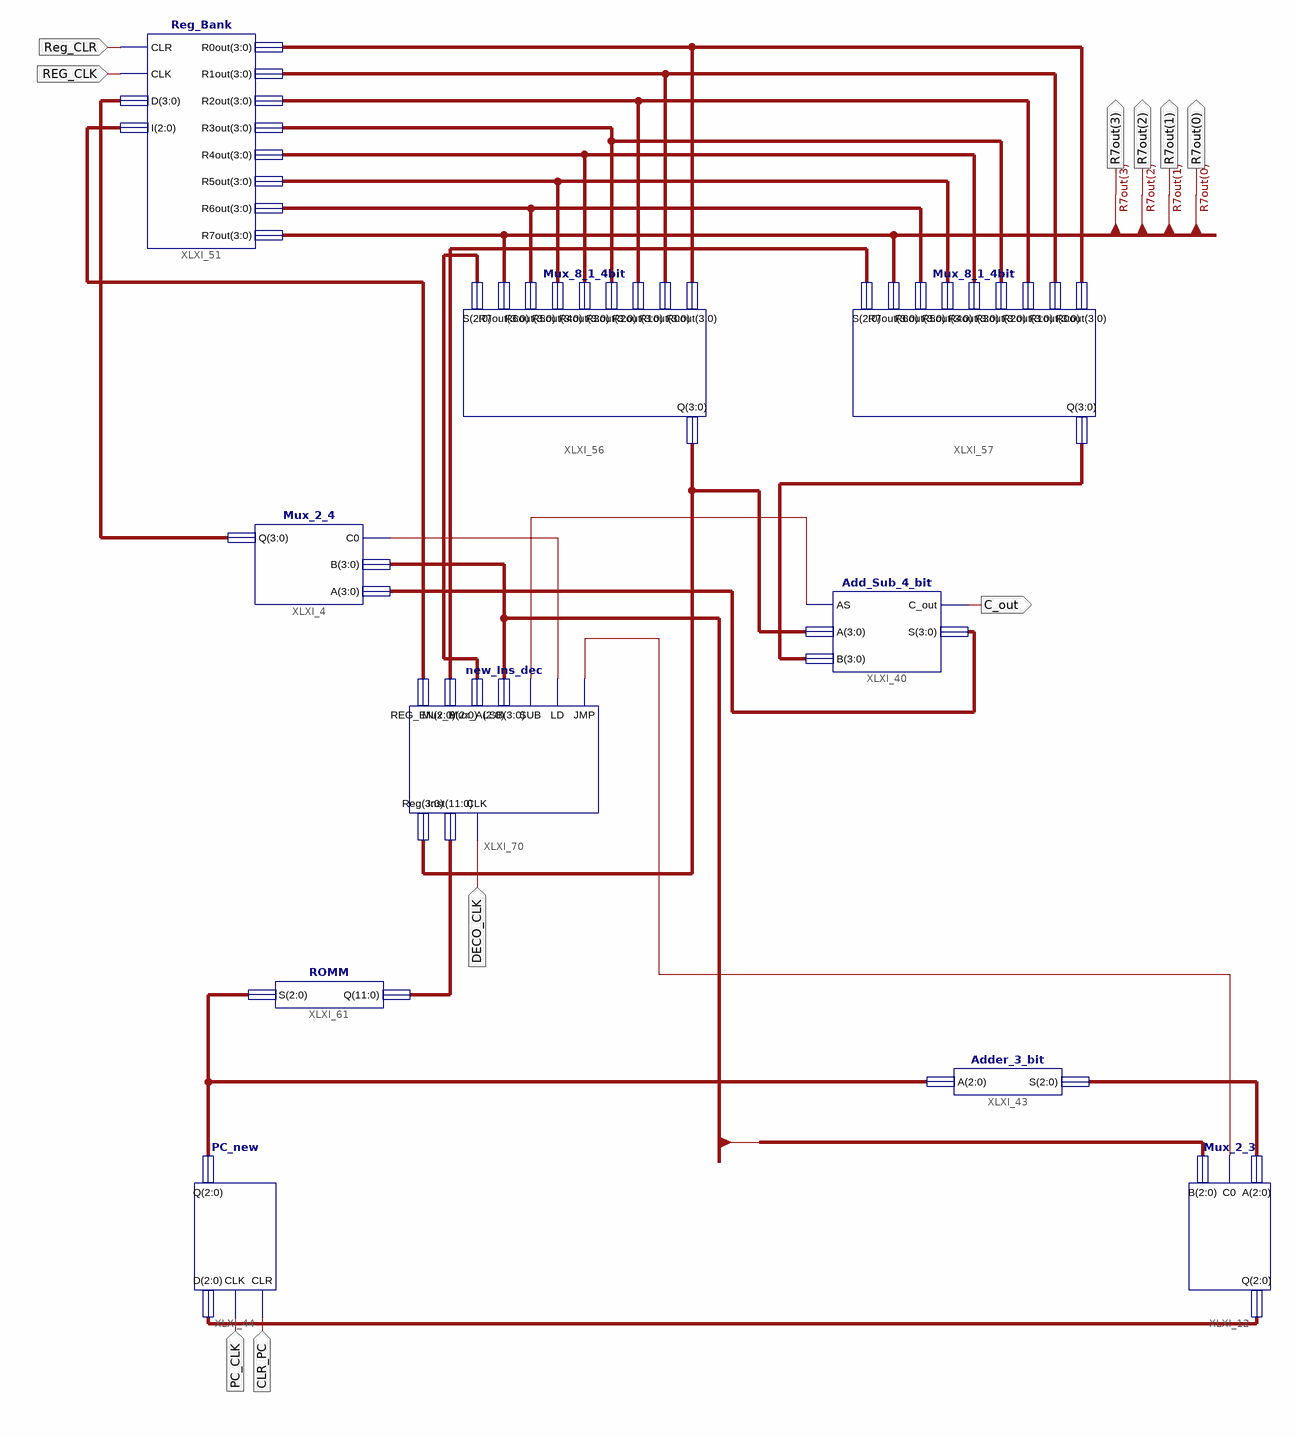
[diagram p0: schematic sheet 1]
// Xilinx ISE schematic NanoProcessor.sch (spartan3e) as structural Verilog: 10 symbols, 10 ports
module NanoProcessor (
  input  Reg_CLR,
  input  CLR_PC,
  input  PC_CLK,
  input  REG_CLK,
  input  DECO_CLK,
  output C_out,
  output [3:0] R7out
);

  wire addresschoice, AS, LD;
  wire [2:0] adder3out, I, MuxAchoice, MuxBchoice, PC_In, PC_Q;
  wire [3:0] A, B, MUX_Out, MuxAout, MuxBout, XLXN_4, XLXN_6, XLXN_7, XLXN_8, XLXN_9, XLXN_11, XLXN_114;
  wire [11:0] ROM_out;

  Mux_2_4 XLXI_4 (.A(A), .B(B), .C0(LD), .Q(MUX_Out));
  Mux_2_3 XLXI_12 (.A(adder3out), .B(B[2:0]), .C0(addresschoice), .Q(PC_In));
  Add_Sub_4_bit XLXI_40 (.A(MuxAout), .AS(AS), .B(MuxBout), .C_out(C_out), .S(A));
  Adder_3_bit XLXI_43 (.A(PC_Q), .S(adder3out));
  PC_new XLXI_44 (.CLK(PC_CLK), .CLR(CLR_PC), .D(PC_In), .Q(PC_Q));
  Reg_Bank XLXI_51 (
    .CLK(REG_CLK), .CLR(Reg_CLR), .D(MUX_Out), .I(I), .R0out(XLXN_4), .R1out(XLXN_114), .R2out(XLXN_6),
    .R3out(XLXN_7), .R4out(XLXN_8), .R5out(XLXN_9), .R6out(XLXN_11), .R7out(R7out));
  Mux_8_1_4bit XLXI_56 (
    .R0out(XLXN_4), .R1out(XLXN_114), .R2out(XLXN_6), .R3out(XLXN_7), .R4out(XLXN_8), .R5out(XLXN_9),
    .R6out(XLXN_11), .R7out(R7out), .S(MuxAchoice), .Q(MuxAout));
  Mux_8_1_4bit XLXI_57 (
    .R0out(XLXN_4), .R1out(XLXN_114), .R2out(XLXN_6), .R3out(XLXN_7), .R4out(XLXN_8), .R5out(XLXN_9),
    .R6out(XLXN_11), .R7out(R7out), .S(MuxBchoice), .Q(MuxBout));
  ROMM XLXI_61 (.Q(ROM_out), .S(PC_Q));
  new_Ins_dec XLXI_70 (
    .CLK(DECO_CLK), .Inst(ROM_out), .JMP(addresschoice), .LD(LD), .LSB(B), .Mux_A(MuxAchoice),
    .Mux_B(MuxBchoice), .Reg(MuxAout), .REG_EN(I), .SUB(AS));
endmodule
